# Altium schematic sheet LEDRelay150.SchDoc
size A; SheetNumber: 2; SheetTotal: 2
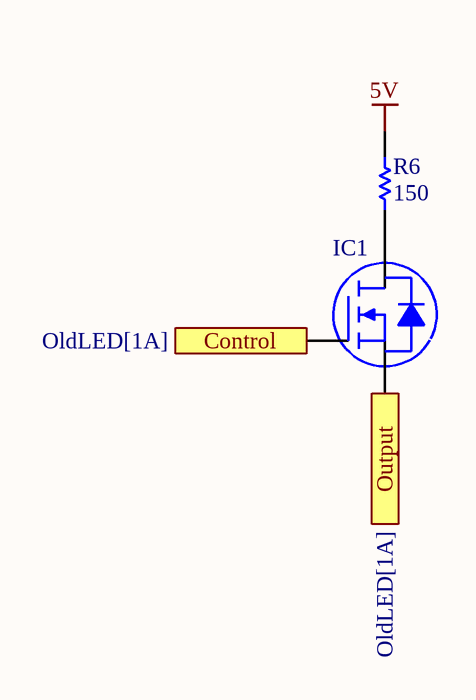
[diagram p0: LEDRelay150.SchDoc]

## Parts
IC1  DMN3023L-7  [DIODES SOT-23-3]  (value not drawn)
R6  value 150  [RESC2013X70X40NL20T20]  (hidden comment: ERJ-6ENF1500V)

## Ports
Control (in, see OldLED[1A]), Output (out, see OldLED[1A])

## Nets
5V: R6.2
Control: IC1.1(G) ; port Control
Output: IC1.2(S) ; port Output
NetIC1_3: IC1.3(D) R6.1

## Library data of the parts
IC1 = CMP-276-000124-1: MOSFET N-CH 30V 6.2A SOT23; Manufacturer: Diodes Incorporated; Rds On (Max) @ Id, Vgs: 25mOhm @ 4A, 10V; Drive Voltage (Max Rds On,  Min Rds On): 2.5V, 10V; Current - Continuous Drain (Id) @ 25°C: 6.2A (Ta); FET Type: N-Channel; Gate Charge (Qg) (Max) @ Vgs: 18.4 nC @ 10 V; Input Capacitance (Ciss) (Max) @ Vds: 873 pF @ 15 V; Vgs (Max): ±20V; Power Dissipation (Max): 900mW (Ta); Vgs(th) (Max) @ Id: 1.8V @ 250µA; Package / Case: TO-236-3, SC-59, SOT-23-3; Mounting Type: Surface Mount; ComponentLink2URL: https://www.digikey.com/en/products/detail/diodes-incorporated/DMN3023L-7/5453119; ComponentLink1Description: Datasheet; Part Status: Active; ComponentLink2Description: DigiKey Link; Packaging: TapeAndReel; ComponentLink1URL: https://www.diodes.com/assets/Datasheets/DMN3023L.pdf; Part Number: DMN3023L-7; Supplier Device Package: SOT-23-3; Operating Temperature: -55°C ~ 150°C (TJ); Series: -; LastUpdated: 9/18/2022 1:01:24 PM; Minimum Order: 1; Price: 0.11; Drain to Source Voltage (Vdss): 30 V; Lifecycle Status: Active; Technology: MOSFET (Metal Oxide)
R6 = CMP-009-00221-1: RES SMD 150 OHM 1% 1/8W 0805; Power Rating: 125mW; Voltage Rating (DC): 150V; Temperature Coefficient: 100ppm/°C; Max Operating Temperature: 155°C; Case Code (Imperial): 0805; Contact Plating: Tin; Pins: 2; Resistor Type: Thick Film; Mounting Technology: Surface Mount; Series: ERJ; Number of Terminations: 2; Tolerance: 1%; Width: 1.2mm; Features: Automotive AEC-Q200; Depth: 1.25mm; Termination: SMD/SMT; RoHS Compliant: Yes; Case Code (Metric): 2012; Package Quantity: 5000; Min Operating Temperature: -55°C; Radiation Hardening: No; Resistance Tolerance: 1%; Construction: Rectangular; Height: 0.6mm; Reach SVHC Compliant: Yes; Voltage Rating: 150V; Packaging: Tape and Reel; Technology: THICK FILM; Lead Free: Lead Free; Length: 2mm; Ratings: AEC-Q200; Case/Package: 0805; Max Power Dissipation: 125mW; Working Voltage: 150V; Military Standard: Not